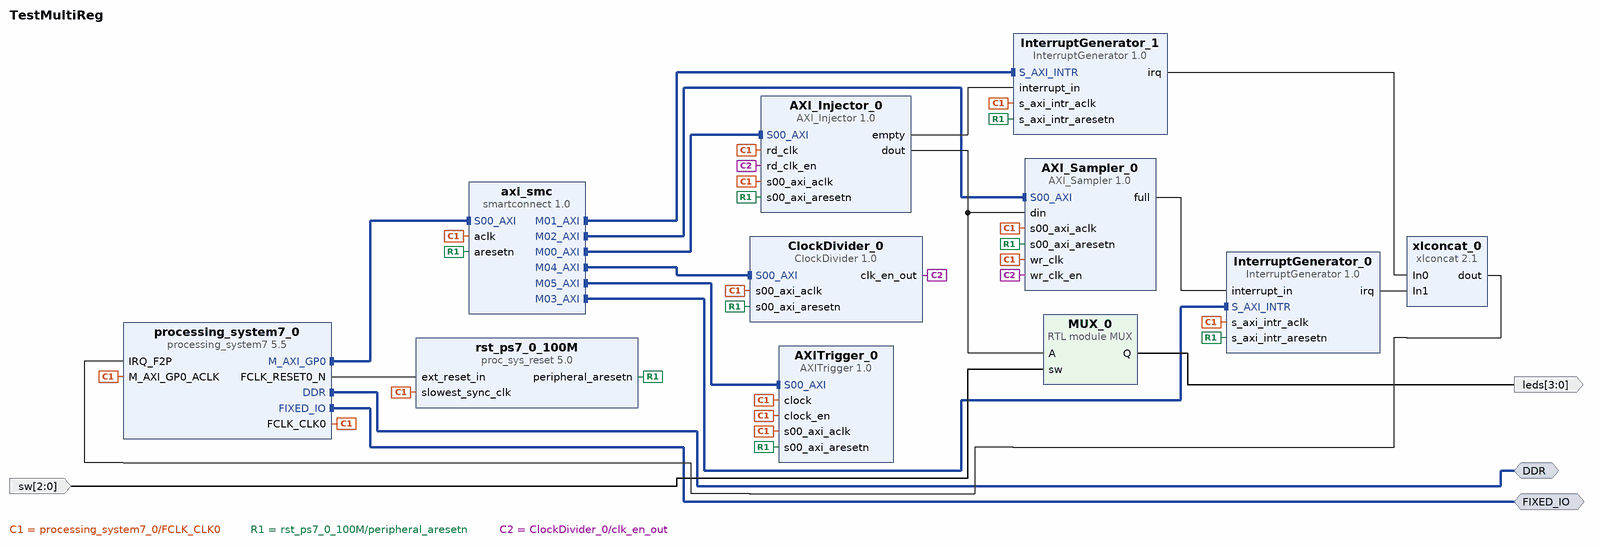
[diagram p0: block diagram of the top level]
# Vivado block design TestMultiReg, xc7z010clg400-1, Vivado 2018.2
create_bd_design TestMultiReg

create_bd_intf_port -mode Master -vlnv xilinx.com:interface:ddrx_rtl:1.0 DDR
create_bd_intf_port -mode Master -vlnv xilinx.com:display_processing_system7:fixedio_rtl:1.0 FIXED_IO
create_bd_port -dir O -from 3 -to 0 leds
create_bd_port -dir I -from 2 -to 0 sw

create_bd_cell -type module -reference MUX MUX_0
create_bd_cell -type ip -vlnv xilinx.com:ip:xlconcat:2.1 xlconcat_0
create_bd_cell -type ip -vlnv xilinx.com:user:AXITrigger:1.0 AXITrigger_0
create_bd_cell -type ip -vlnv xilinx.com:user:AXI_Injector:1.0 AXI_Injector_0
create_bd_cell -type ip -vlnv xilinx.com:user:AXI_Sampler:1.0 AXI_Sampler_0
create_bd_cell -type ip -vlnv xilinx.com:user:ClockDivider:1.0 ClockDivider_0
create_bd_cell -type ip -vlnv xilinx.com:user:InterruptGenerator:1.0 InterruptGenerator_0
create_bd_cell -type ip -vlnv xilinx.com:user:InterruptGenerator:1.0 InterruptGenerator_1
create_bd_cell -type ip -vlnv xilinx.com:ip:smartconnect:1.0 axi_smc
set_property -dict {CONFIG.NUM_MI 6 CONFIG.NUM_SI 1} [get_bd_cells axi_smc]
create_bd_cell -type ip -vlnv xilinx.com:ip:processing_system7:5.5 processing_system7_0
set_property -dict [list \
  CONFIG.PCW_UIPARAM_DDR_FREQ_MHZ 525 \
  CONFIG.PCW_CRYSTAL_PERIPHERAL_FREQMHZ 50.000000 \
  CONFIG.PCW_APU_PERIPHERAL_FREQMHZ 650 \
  CONFIG.PCW_UART_PERIPHERAL_FREQMHZ 100 \
  CONFIG.PCW_FPGA0_PERIPHERAL_FREQMHZ 100 \
  CONFIG.PCW_FPGA1_PERIPHERAL_FREQMHZ 50 \
  CONFIG.PCW_USE_FABRIC_INTERRUPT 1 \
  CONFIG.PCW_IRQ_F2P_INTR 1 \
  CONFIG.PCW_PERIPHERAL_BOARD_PRESET part0 \
  CONFIG.PCW_PRESET_BANK1_VOLTAGE {LVCMOS 1.8V} \
  CONFIG.PCW_UIPARAM_DDR_PARTNO {MT41K128M16 JT-125} \
  CONFIG.PCW_QSPI_PERIPHERAL_ENABLE 0 \
  CONFIG.PCW_ENET0_PERIPHERAL_ENABLE 0 \
  CONFIG.PCW_SD0_PERIPHERAL_ENABLE 0 \
  CONFIG.PCW_UART1_PERIPHERAL_ENABLE 1 \
  CONFIG.PCW_UART1_UART1_IO {MIO 48 .. 49} \
  CONFIG.PCW_TTC0_PERIPHERAL_ENABLE 1 \
  CONFIG.PCW_TTC0_TTC0_IO {MIO 18 .. 19} \
  CONFIG.PCW_USB0_PERIPHERAL_ENABLE 0 \
  CONFIG.PCW_GPIO_MIO_GPIO_ENABLE 0 \
] [get_bd_cells processing_system7_0]
# 351 more settings of processing_system7_0 are not shown: defaults, MIO pin electricals, DDR timing, and values the tool derives
create_bd_cell -type ip -vlnv xilinx.com:ip:proc_sys_reset:5.0 rst_ps7_0_100M

# ---- connections ----

connect_bd_intf_net [get_bd_intf_pins processing_system7_0/M_AXI_GP0] [get_bd_intf_pins axi_smc/S00_AXI]
connect_bd_intf_net [get_bd_intf_pins axi_smc/M04_AXI] [get_bd_intf_pins ClockDivider_0/S00_AXI]
connect_bd_intf_net [get_bd_intf_pins axi_smc/M00_AXI] [get_bd_intf_pins AXI_Injector_0/S00_AXI]
connect_bd_intf_net [get_bd_intf_pins axi_smc/M02_AXI] [get_bd_intf_pins AXI_Sampler_0/S00_AXI]
connect_bd_intf_net [get_bd_intf_pins axi_smc/M03_AXI] [get_bd_intf_pins InterruptGenerator_0/S_AXI_INTR]
connect_bd_intf_net [get_bd_intf_pins axi_smc/M01_AXI] [get_bd_intf_pins InterruptGenerator_1/S_AXI_INTR]
connect_bd_intf_net [get_bd_intf_pins axi_smc/M05_AXI] [get_bd_intf_pins AXITrigger_0/S00_AXI]
connect_bd_intf_net [get_bd_intf_ports DDR] [get_bd_intf_pins processing_system7_0/DDR]
connect_bd_intf_net [get_bd_intf_ports FIXED_IO] [get_bd_intf_pins processing_system7_0/FIXED_IO]
connect_bd_net [get_bd_pins processing_system7_0/FCLK_CLK0] \
  [get_bd_pins AXITrigger_0/s00_axi_aclk] [get_bd_pins AXI_Injector_0/rd_clk] [get_bd_pins AXI_Injector_0/s00_axi_aclk] \
  [get_bd_pins AXI_Sampler_0/wr_clk] [get_bd_pins AXI_Sampler_0/s00_axi_aclk] [get_bd_pins ClockDivider_0/s00_axi_aclk] \
  [get_bd_pins InterruptGenerator_0/s_axi_intr_aclk] [get_bd_pins InterruptGenerator_1/s_axi_intr_aclk] \
  [get_bd_pins axi_smc/aclk] [get_bd_pins processing_system7_0/M_AXI_GP0_ACLK] [get_bd_pins rst_ps7_0_100M/slowest_sync_clk] \
  [get_bd_pins AXITrigger_0/clock] [get_bd_pins AXITrigger_0/clock_en]
connect_bd_net [get_bd_pins processing_system7_0/FCLK_RESET0_N] [get_bd_pins rst_ps7_0_100M/ext_reset_in]
connect_bd_net [get_bd_pins rst_ps7_0_100M/peripheral_aresetn] \
  [get_bd_pins AXITrigger_0/s00_axi_aresetn] [get_bd_pins AXI_Injector_0/s00_axi_aresetn] \
  [get_bd_pins AXI_Sampler_0/s00_axi_aresetn] [get_bd_pins ClockDivider_0/s00_axi_aresetn] \
  [get_bd_pins InterruptGenerator_0/s_axi_intr_aresetn] [get_bd_pins InterruptGenerator_1/s_axi_intr_aresetn] \
  [get_bd_pins axi_smc/aresetn]
connect_bd_net [get_bd_pins MUX_0/Q] [get_bd_ports leds]
connect_bd_net [get_bd_ports sw] [get_bd_pins MUX_0/sw]
connect_bd_net [get_bd_pins xlconcat_0/dout] [get_bd_pins processing_system7_0/IRQ_F2P]
connect_bd_net -net TestMultiReg_0_dout [get_bd_pins AXI_Injector_0/dout] [get_bd_pins MUX_0/A] [get_bd_pins AXI_Sampler_0/din]
connect_bd_net [get_bd_pins ClockDivider_0/clk_en_out] [get_bd_pins AXI_Injector_0/rd_clk_en] [get_bd_pins AXI_Sampler_0/wr_clk_en]
# net AXI_Injector_0_sync_out has one end: 
connect_bd_net [get_bd_pins AXI_Sampler_0/full] [get_bd_pins InterruptGenerator_0/interrupt_in]
connect_bd_net [get_bd_pins InterruptGenerator_0/irq] [get_bd_pins xlconcat_0/In1]
connect_bd_net [get_bd_pins AXI_Injector_0/empty] [get_bd_pins InterruptGenerator_1/interrupt_in]
connect_bd_net [get_bd_pins InterruptGenerator_1/irq] [get_bd_pins xlconcat_0/In0]

# ---- address map ----
assign_bd_address -offset 0x43C00000 -range 64K -target_address_space [get_bd_addr_spaces processing_system7_0/Data] [get_bd_addr_segs InterruptGenerator_1/S_AXI_INTR/S_AXI_INTR_reg]
assign_bd_address -offset 0x43C10000 -range 64K -target_address_space [get_bd_addr_spaces processing_system7_0/Data] [get_bd_addr_segs InterruptGenerator_0/S_AXI_INTR/S_AXI_INTR_reg]
assign_bd_address -offset 0x7AA00000 -range 64K -target_address_space [get_bd_addr_spaces processing_system7_0/Data] [get_bd_addr_segs AXI_Injector_0/S00_AXI/S00_AXI_mem]
assign_bd_address -offset 0x7AA10000 -range 64K -target_address_space [get_bd_addr_spaces processing_system7_0/Data] [get_bd_addr_segs AXI_Sampler_0/S00_AXI/S00_AXI_mem]
assign_bd_address -offset 0x7AA20000 -range 64K -target_address_space [get_bd_addr_spaces processing_system7_0/Data] [get_bd_addr_segs ClockDivider_0/S00_AXI/S00_AXI_mem]
assign_bd_address -offset 0x7AA30000 -range 64K -target_address_space [get_bd_addr_spaces processing_system7_0/Data] [get_bd_addr_segs AXITrigger_0/S00_AXI/S00_AXI_mem]

validate_bd_design
save_bd_design
